# Altium project epd42.PrjPcb
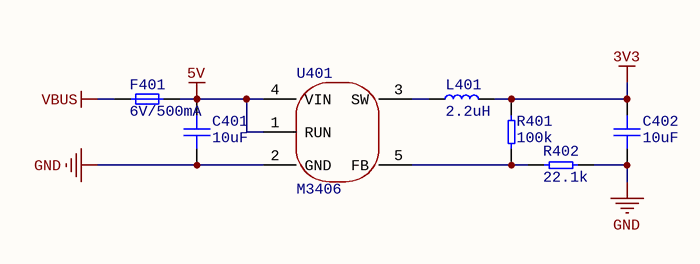
[diagram p0: m3406.SchDoc]
5 sheets, 13 parts. Net scope: flat (ports and power ports of the same name join across sheets).
Sheets:
  m3406.SchDoc
  type-c.SchDoc
  usb-power.SchDoc
  charger.SchDoc
  esp32c3-02.SchDoc

## Sheet m3406.SchDoc
size A4; SheetNumber: 4; SheetTotal: 4

### Parts
C401  10uF  [fp-0006]
C402  10uF  [fp-0006]
F401  6V/500mA  [fp-0008]
L401  2.2uH  [fp-0021]
R401  100k  [fp-0002]
R402  22.1k  [fp-0002]
U401  M3406  [fp-0020]

### Nets
3V3: C402.2 L401.2 R401.2
5V: C401.2 F401.2 U401.1(RUN) U401.4(VIN)
GND: C401.1 C402.1 R402.2 U401.2(GND)
VBUS: F401.1
NetL401_1: L401.1 U401.3(SW)
NetR401_1: R401.1 R402.1 U401.5(FB)

### Library data of the parts
C401 C402 = CMP-0000026: 10V 10uF X5R ±10% 0603 Multilayer Ceramic Capacitors MLCC - SMD/SMT ROHS; MPN: TCC0603X5R106K100CT; Manufacturer: CCTC; CPN: 000000; ID: CMP-0000026; Category: Capacitors; GPN: 10uF; ComponentLink1Description: Product Link; ComponentLink2Description: Datasheet Link; LCSC PN: C380314
F401 = CMP-0000015: 6V 500mA 100A 1A 0805 Resettable Fuses ROHS; MPN: SMD0805B050TF; Manufacturer: BrightKing; CPN: 000000; ID: CMP-0000015; Category: Fuses; GPN: 6V/500mA; ComponentLink1Description: Product Link; ComponentLink1URL: https://brightking.yageo.com/Products/info_12.aspx?itemid=1343; ComponentLink2Description: Datasheet Link; ComponentLink2URL: https://brightking.yageo.com/uploadfiles/file/PTC/2022042723144014408764.pdf; LCSC PN: C269104
L401 = CMP-0000031: 2.2uH SMD,2x1.6mm Power Inductors ROHS; MPN: SFE201610-2R2M; Manufacturer: DDY; CPN: 10011400052; ID: CMP-0000031; Category: Inductors; GPN: 2.2uH; ComponentLink1Description: Product Link; ComponentLink1URL: https://www.lcsc.com/product-detail/Power-Inductors_DDY-SFE201610-2R2M_C5159659.html; ComponentLink2Description: Datasheet Link; ComponentLink2URL: https://www.lcsc.com/datasheet/lcsc_datasheet_2210091830_DDY-SFE201610-2R2M_C5159659.pdf; LCSC PN: C5159659
R401 = CMP-0000003: 62.5mW Thick Film Resistors 50V ±100ppm/℃ ±1% 100kΩ 0402 Chip Resistor - Surface Mount ROHS; MPN: RTT021003FTH; Manufacturer: RALEC; CPN: 000000; ID: CMP-0000003; Category: Resistors; GPN: 100k; ComponentLink1Description: Product Link; ComponentLink2Description: Datasheet Link; LCSC PN: C102750
R402 = CMP-0000030: 62.5mW Thick Film Resistors 50V ±100ppm/℃ ±1% 22.1kΩ 0402 Chip Resistor - Surface Mount ROHS; MPN: 0402WGF2212TCE; Manufacturer: UNI-ROYAL; CPN: 000000; ID: CMP-0000030; Category: Resistors; GPN: 22.1k; ComponentLink1Description: Product Link; ComponentLink2Description: Datasheet Link; LCSC PN: C43473
U401 = CMP-0000036: Step-down type SOT-23-5 DC-DC Converters ROHS; MPN: M3406-ADJ; Manufacturer: AEROSEMI; CPN: 10010200097; ID: CMP-0000036; Category: ICs; GPN: M3406; ComponentLink1Description: Product Link; ComponentLink1URL: https://www.lcsc.com/product-detail/DC-DC-Converters_XI-AN-Aerosemi-Tech-M3406-ADJ_C83224.html; ComponentLink2Description: Datasheet Link; ComponentLink2URL: https://www.lcsc.com/datasheet/lcsc_datasheet_2304140030_XI-AN-Aerosemi-Tech-M3406-ADJ_C83224.pdf; LCSC PN: C83224

## Sheet type-c.SchDoc
size A4; SheetNumber: 3; SheetTotal: 4
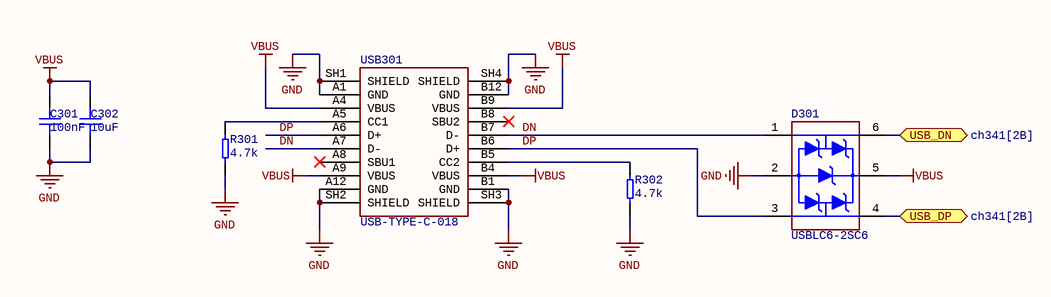
[diagram p1: type-c.SchDoc]

### Parts
C301  100nF  [fp-0005]
C302  10uF  [fp-0006]
D301  USBLC6-2SC6  [fp-0018]
R301  4.7k  [fp-0002]
R302  4.7k  [fp-0002]
USB301  USB-TYPE-C-018  [fp-0017]

### Ports
USB_DN (bidir, see ch341[2B]), USB_DP (bidir, see ch341[2B])

### Nets
GND: C301.1 C302.1 D301.2 R301.1 R302.1 USB301.A1(GND) USB301.A12(GND) USB301.B1(GND) USB301.B12(GND) USB301.SH1(SHIELD) USB301.SH2(SHIELD) USB301.SH3(SHIELD) USB301.SH4(SHIELD)
VBUS: C301.2 C302.2 D301.5 USB301.A4(VBUS) USB301.A9(VBUS) USB301.B4(VBUS) USB301.B9(VBUS)
DN: D301.1 USB301.A7(D-) USB301.B7(D-)
DP: D301.3 USB301.A6(D+) USB301.B6(D+)
NetD301_4: D301.4 ; port USB_DP
NetD301_6: D301.6 ; port USB_DN
NetR301_2: R301.2 USB301.A5(CC1)
NetR302_2: R302.2 USB301.B5(CC2)

Not connected (* = marked no-connect by the designer): USB301 A8(SBU1)* B8(SBU2)*

### Library data of the parts
C301 = CMP-0000024: 25V 100nF X5R ±20% 0402 Multilayer Ceramic Capacitors MLCC - SMD/SMT ROHS; MPN: TCC0402X5R104M250AT; Manufacturer: CCTC; CPN: 000000; ID: CMP-0000024; Category: Capacitors; GPN: 100nF; ComponentLink1Description: Product Link; ComponentLink2Description: Datasheet Link; LCSC PN: C359190
C302 = CMP-0000026: as C401 on sheet m3406; ID: CMP-0000026; Category: Capacitors; GPN: 10uF; ComponentLink1Description: Product Link; ComponentLink2Description: Datasheet Link; LCSC PN: C380314
D301 = CMP-0000065: 15V 6V SOT-23-6 Electrostatic and Surge Protection (TVS/ESD) ROHS; Manufacturer: UMW; CPN: 000000; ID: CMP-0000065; MPN: USBLC6-2SC6; Category: TVS/ESD; ComponentLink1Description: Product Link; ComponentLink1URL: https://www.lcsc.com/product-detail/Electrostatic-and-Surge-Protection-TVS-ESD_UMW-Youtai-Semiconductor-Co-Ltd-USBLC6-2SC6_C2687116.html; ComponentLink2Description: Datasheet Link; ComponentLink2URL: https://datasheet.lcsc.com/lcsc/2311091738_UMW-Youtai-Semiconductor-Co---Ltd--USBLC6-2SC6_C2687116.pdf; LCSC PN: C2687116
R301 R302 = CMP-0000006: 62.5mW Thick Film Resistors 50V ±100ppm/℃ ±5% 4.7kΩ 0402 Chip Resistor - Surface Mount ROHS; MPN: RTT02472JTH; Manufacturer: RALEC; CPN: 000000; ID: CMP-0000006; Category: Resistors; GPN: 4.7k; ComponentLink1Description: Product Link; ComponentLink2Description: Datasheet Link; LCSC PN: C103059
USB301 = CMP-0000023: 3A 1 Surface Mount，Right Angle 16P Female -25℃~+85℃ Type-C SMD USB Connectors ROHS; Manufacturer: DEALON; GPN: TYPEC; CPN: 000000; ID: CMP-0000023; MPN: USB-TYPE-C-018; Category: Connectors; ComponentLink1Description: Product Link; ComponentLink1URL: https://www.lcsc.com/product-detail/span-style-background-color-ff0-USB-span-Connectors_DEALON-USB-TYPE-C-018_C2927038.html; ComponentLink2Description: Datasheet Link; ComponentLink2URL: https://www.lcsc.com/datasheet/lcsc_datasheet_2201121330_DEALON-USB-TYPE-C-018_C2927038.pdf; LCSC PN: C2927038

## Sheet usb-power.SchDoc
size A4; SheetNumber: 3; SheetTotal: 3

## Sheet charger.SchDoc
size A4; SheetNumber: 4; SheetTotal: 4

## Sheet esp32c3-02.SchDoc
size A4; SheetNumber: 5; SheetTotal: 5

## Nets that join several sheets
GND: m3406 (C401.1 C402.1 R402.2 U401.2), type-c (13 pins)
VBUS: m3406 (F401.1), type-c (7 pins)